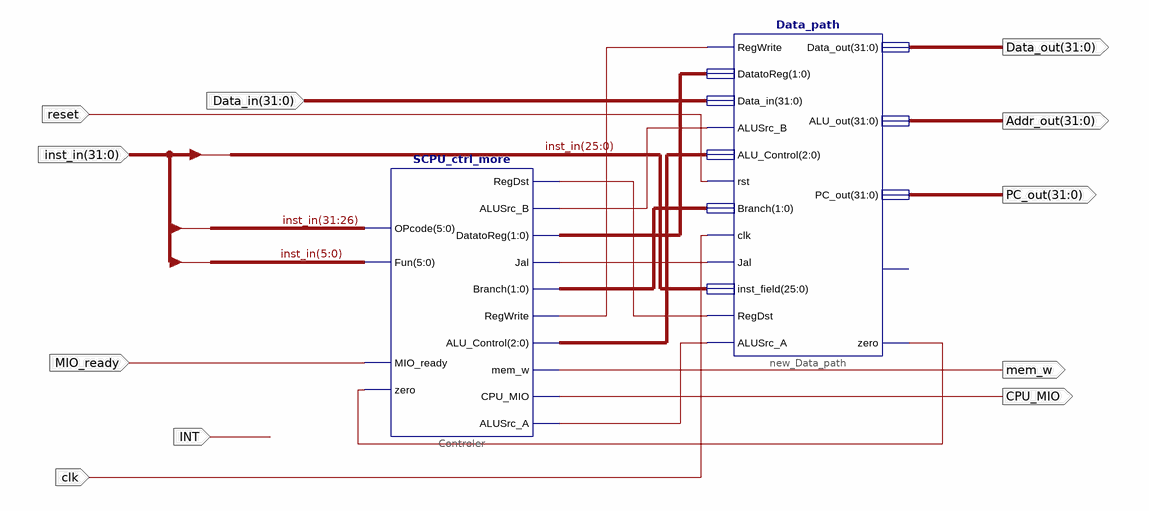
[diagram p0: schematic sheet 1]
// Xilinx ISE schematic SCPU.sch (kintex7) as structural Verilog: 2 symbols, 11 ports
module SCPU (
  input  clk,
  input  reset,
  input  [31:0] inst_in,
  input  MIO_ready,
  input  INT,
  input  [31:0] Data_in,
  output [31:0] Data_out,
  output mem_w,
  output CPU_MIO,
  output [31:0] PC_out,
  output [31:0] Addr_out
);

  wire XLXN_91, XLXN_92, XLXN_96, XLXN_97, XLXN_99, XLXN_101;
  wire [1:0] XLXN_98, XLXN_100;
  wire [2:0] XLXN_102;

  SCPU_ctrl_more Controler (
    .MIO_ready(MIO_ready), .zero(XLXN_91), .OPcode(inst_in[31:26]), .Fun(inst_in[5:0]), .RegDst(XLXN_96),
    .ALUSrc_B(XLXN_97), .Jal(XLXN_99), .RegWrite(XLXN_101), .mem_w(mem_w), .CPU_MIO(CPU_MIO),
    .DatatoReg(XLXN_98), .Branch(XLXN_100), .ALU_Control(XLXN_102), .ALUSrc_A(XLXN_92));
  Data_path new_Data_path (
    .RegWrite(XLXN_101), .DatatoReg(XLXN_98), .Data_in(Data_in), .ALUSrc_B(XLXN_97), .ALU_Control(XLXN_102),
    .rst(reset), .Branch(XLXN_100), .clk(clk), .Jal(XLXN_99), .inst_field(inst_in[25:0]), .RegDst(XLXN_96),
    .ALUSrc_A(XLXN_92), .Data_out(Data_out), .ALU_out(Addr_out), .PC_out(PC_out), .zero(XLXN_91));  // open: overflow
endmodule
